# Altium project Motherboard.PrjPcb
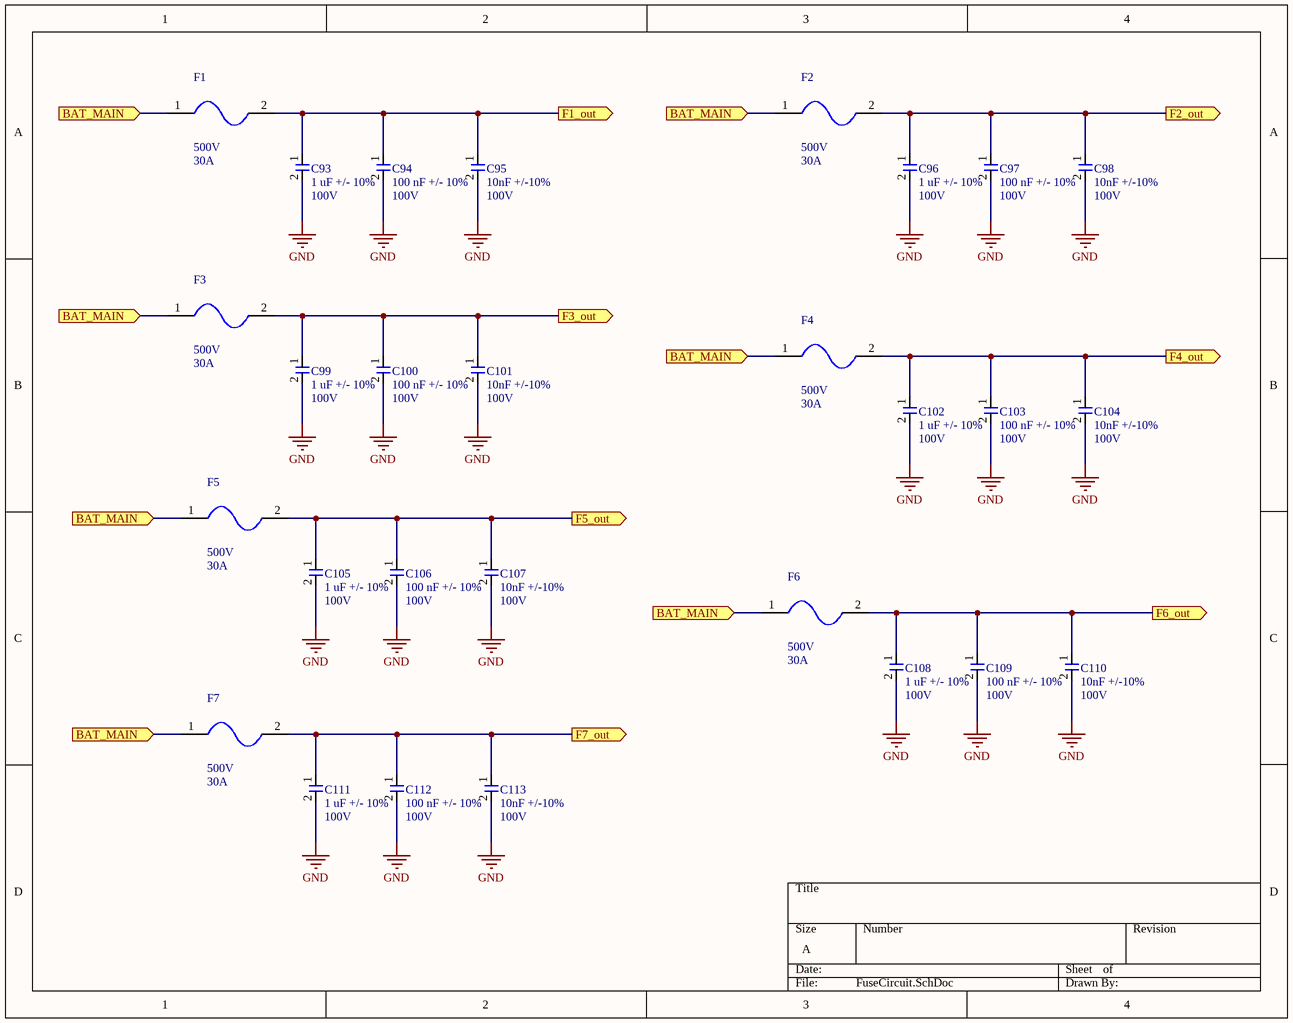
[diagram p0: FuseCircuit.SchDoc]
2 sheets, 41 parts. Net scope: flat (ports and power ports of the same name join across sheets).
Board file: Motherboard.PcbDoc
Sheets:
  FuseCircuit.SchDoc
  MCU_Headers.SchDoc

## Sheet FuseCircuit.SchDoc
size A; SheetNumber: 6; SheetTotal: 8

### Parts
C93  Capacitance: 1 uF +/- 10%  Voltage: 100V  [CAP-1206 - duplicate]  (hidden comment: C1206X105K101T)
C94  Capacitance: 100 nF +/- 10%  Voltage: 100V  [CAP-0603]  (hidden comment: CC0603KRX7R0BB104)
C95  Capacitance: 10nF +/-10%  Voltage Rating: 100V  [CAP-0603]  (hidden comment: CC0603KRX7R0BB103)
C96  Capacitance: 1 uF +/- 10%  Voltage: 100V  [CAP-1206 - duplicate]  (hidden comment: C1206X105K101T)
C97  Capacitance: 100 nF +/- 10%  Voltage: 100V  [CAP-0603]  (hidden comment: CC0603KRX7R0BB104)
C98  Capacitance: 10nF +/-10%  Voltage Rating: 100V  [CAP-0603]  (hidden comment: CC0603KRX7R0BB103)
C99  Capacitance: 1 uF +/- 10%  Voltage: 100V  [CAP-1206 - duplicate]  (hidden comment: C1206X105K101T)
C100  Capacitance: 100 nF +/- 10%  Voltage: 100V  [CAP-0603]  (hidden comment: CC0603KRX7R0BB104)
C101  Capacitance: 10nF +/-10%  Voltage Rating: 100V  [CAP-0603]  (hidden comment: CC0603KRX7R0BB103)
C102  Capacitance: 1 uF +/- 10%  Voltage: 100V  [CAP-1206 - duplicate]  (hidden comment: C1206X105K101T)
C103  Capacitance: 100 nF +/- 10%  Voltage: 100V  [CAP-0603]  (hidden comment: CC0603KRX7R0BB104)
C104  Capacitance: 10nF +/-10%  Voltage Rating: 100V  [CAP-0603]  (hidden comment: CC0603KRX7R0BB103)
C105  Capacitance: 1 uF +/- 10%  Voltage: 100V  [CAP-1206 - duplicate]  (hidden comment: C1206X105K101T)
C106  Capacitance: 100 nF +/- 10%  Voltage: 100V  [CAP-0603]  (hidden comment: CC0603KRX7R0BB104)
C107  Capacitance: 10nF +/-10%  Voltage Rating: 100V  [CAP-0603]  (hidden comment: CC0603KRX7R0BB103)
C108  Capacitance: 1 uF +/- 10%  Voltage: 100V  [CAP-1206 - duplicate]  (hidden comment: C1206X105K101T)
C109  Capacitance: 100 nF +/- 10%  Voltage: 100V  [CAP-0603]  (hidden comment: CC0603KRX7R0BB104)
C110  Capacitance: 10nF +/-10%  Voltage Rating: 100V  [CAP-0603]  (hidden comment: CC0603KRX7R0BB103)
C111  Capacitance: 1 uF +/- 10%  Voltage: 100V  [CAP-1206 - duplicate]  (hidden comment: C1206X105K101T)
C112  Capacitance: 100 nF +/- 10%  Voltage: 100V  [CAP-0603]  (hidden comment: CC0603KRX7R0BB104)
C113  Capacitance: 10nF +/-10%  Voltage Rating: 100V  [CAP-0603]  (hidden comment: CC0603KRX7R0BB103)
F1  Voltage Rating: 500V  Current: 30A  [FUSE-ATM-0001]  (hidden comment: 3568)
F2  Voltage Rating: 500V  Current: 30A  [FUSE-ATM-0001]  (hidden comment: 3568)
F3  Voltage Rating: 500V  Current: 30A  [FUSE-ATM-0001]  (hidden comment: 3568)
F4  Voltage Rating: 500V  Current: 30A  [FUSE-ATM-0001]  (hidden comment: 3568)
F5  Voltage Rating: 500V  Current: 30A  [FUSE-ATM-0001]  (hidden comment: 3568)
F6  Voltage Rating: 500V  Current: 30A  [FUSE-ATM-0001]  (hidden comment: 3568)
F7  Voltage Rating: 500V  Current: 30A  [FUSE-ATM-0001]  (hidden comment: 3568)

### Ports
BAT_MAIN (in), F1_out (out), F2_out (out), F3_out (out), F4_out (out), F5_out (out), F6_out (out), F7_out (out)

### Nets
GND: C93.2 C94.2 C95.2 C96.2 C97.2 C98.2 C99.2 C100.2 C101.2 C102.2 C103.2 C104.2 C105.2 C106.2 C107.2 C108.2 C109.2 C110.2 C111.2 C112.2 C113.2
NetC93_1: C93.1 C94.1 C95.1 F1.2 ; port F1_out
NetC96_1: C96.1 C97.1 C98.1 F2.2 ; port F2_out
NetC99_1: C99.1 C100.1 C101.1 F3.2 ; port F3_out
NetC102_1: C102.1 C103.1 C104.1 F4.2 ; port F4_out
NetC105_1: C105.1 C106.1 C107.1 F5.2 ; port F5_out
NetC108_1: C108.1 C109.1 C110.1 F6.2 ; port F6_out
NetC111_1: C111.1 C112.1 C113.1 F7.2 ; port F7_out
NetF1_1: F1.1 F2.1 F3.1 F4.1 F5.1 F6.1 F7.1 ; port BAT_MAIN

### Library data of the parts
C93 C96 C99 C102 C105 C108 C111 = CAP-1U-0004-JLC: 100V 1uF X7R ±10% 1206 Multilayer Ceramic Capacitors MLCC - SMD/SMT ROHS; assembled: yes; JLC Part Number: C106026
C94 C97 C100 C103 C106 C109 C112 = CAP-100N-0002-JLC: 100V 100nF X7R ±10% 0603 Multilayer Ceramic Capacitors MLCC - SMD/SMT ROHS; assembled?: yes; JLC Part Number: C113803
C95 C98 C101 C104 C107 C110 C113 = CAP-10N-0003-JLC: 100V 10nF X7R ±10% 0603 Multilayer Ceramic Capacitors MLCC - SMD/SMT ROHS; Manufacturer: Yageo; Assembled?: yes; Manufacturer Part Number: CC0603KRX7R0BB103; Temperature Coefficient: X7R; Package Size: 0603; JLC Part Number: C107059
F1-F7 = FUSE-ATM-0001: Fuse Holder 30 A 500V 1 Circuit Blade Through Hole; Manufacturer Part Number: 3568

## Sheet MCU_Headers.SchDoc
size A; SheetNumber: 7; SheetTotal: 8
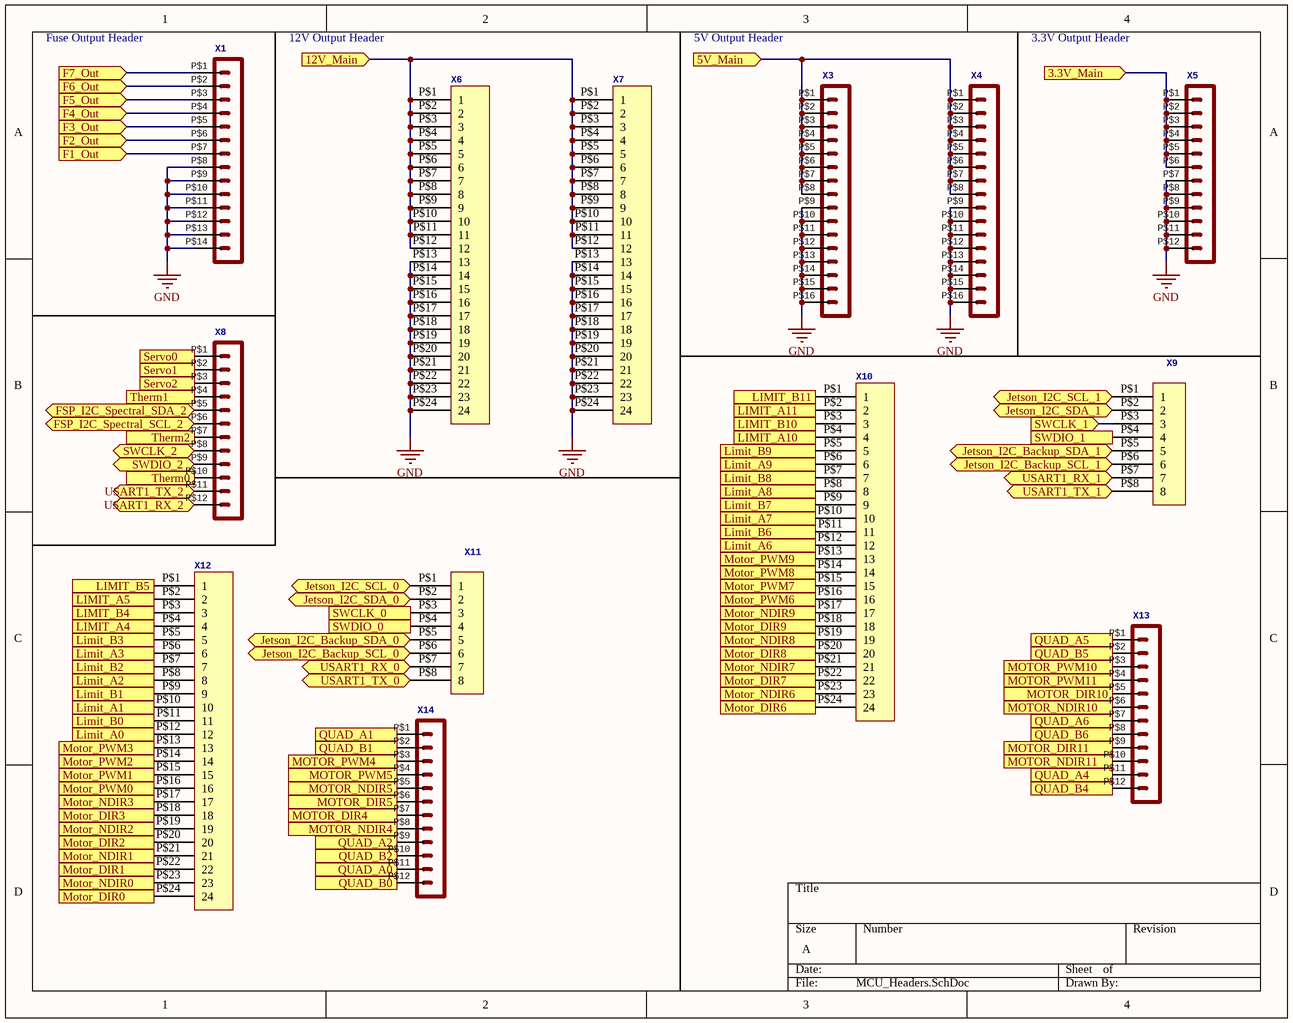
[diagram p1: MCU_Headers.SchDoc]

### Parts
X1  Molex - Micro-Fit 3.0 Series connector,  3.00mm (0.118") pitch header, 14 positions.  [43045-1412]  (value not drawn)
X3  Molex - Micro-Fit 3.0 Series connector,  3.00mm (0.118") pitch header, 16 positions.  [43045-1612]  (value not drawn)
X4  Molex - Micro-Fit 3.0 Series connector,  3.00mm (0.118") pitch header, 16 positions.  [43045-1612]  (value not drawn)
X5  Molex - Micro-Fit 3.0 Series connector,  3.00mm (0.118") pitch header, 12 positions.  [43045-1212]  (value not drawn)
X6  Molex 43045-2412  [43045-2412]  (value not drawn)
X7  Molex 43045-2412  [43045-2412]  (value not drawn)
X8  Molex - Micro-Fit 3.0 Series connector,  3.00mm (0.118") pitch header, 12 positions.  [43045-1212]  (value not drawn)
X9  Molex 43045-0812  [43045-0812]  (value not drawn)
X10  Molex 43045-2412  [43045-2412]  (value not drawn)
X11  Molex 43045-0812  [43045-0812]  (value not drawn)
X12  Molex 43045-2412  [43045-2412]  (value not drawn)
X13  Molex - Micro-Fit 3.0 Series connector,  3.00mm (0.118") pitch header, 12 positions.  [43045-1212]  (value not drawn)
X14  Molex - Micro-Fit 3.0 Series connector,  3.00mm (0.118") pitch header, 12 positions.  [43045-1212]  (value not drawn)

### Ports
3.3V_Main (in), 5V_Main (in), 12V_Main (in), F1_Out (in), F2_Out (in), F3_Out (in), F4_Out (in), F5_Out (in), F6_Out (in), F7_Out (in), FSP_I2C_Spectral_SCL_2 (bidir), FSP_I2C_Spectral_SDA_2 (bidir), Jetson_I2C_Backup_SCL_0 (bidir), Jetson_I2C_Backup_SCL_1 (bidir), Jetson_I2C_Backup_SDA_0 (bidir), Jetson_I2C_Backup_SDA_1 (bidir), Jetson_I2C_SCL_0 (bidir), Jetson_I2C_SCL_1 (bidir), Jetson_I2C_SDA_0 (bidir), Jetson_I2C_SDA_1 (bidir), Limit_A0 (in), Limit_A1 (in), Limit_A2 (in), Limit_A3 (in), LIMIT_A4 (in), LIMIT_A5 (in), Limit_A6 (out), Limit_A7 (out), Limit_A8 (out), Limit_A9 (out), LIMIT_A10 (in), LIMIT_A11 (in), Limit_B0 (in), Limit_B1 (in), Limit_B2 (in), Limit_B3 (in), LIMIT_B4 (in), LIMIT_B5 (in), Limit_B6 (out), Limit_B7 (out), Limit_B8 (out), Limit_B9 (out), LIMIT_B10 (in), LIMIT_B11 (in), Motor_DIR0 (in), Motor_DIR1 (in), Motor_DIR2 (in), Motor_DIR3 (in), MOTOR_DIR4 (in), MOTOR_DIR5 (in), Motor_DIR6 (out), Motor_DIR7 (out), Motor_DIR8 (out), Motor_DIR9 (out), MOTOR_DIR10 (in), MOTOR_DIR11 (in), Motor_NDIR0 (in), Motor_NDIR1 (in), Motor_NDIR2 (in), Motor_NDIR3 (in), MOTOR_NDIR4 (in), MOTOR_NDIR5 (in), Motor_NDIR6 (out), Motor_NDIR7 (out), Motor_NDIR8 (out), Motor_NDIR9 (out), MOTOR_NDIR10 (in), MOTOR_NDIR11 (in), Motor_PWM0 (in), Motor_PWM1 (in), Motor_PWM2 (in), Motor_PWM3 (in), MOTOR_PWM4 (in), MOTOR_PWM5 (in), Motor_PWM6 (out), Motor_PWM7 (out), Motor_PWM8 (out), Motor_PWM9 (out), MOTOR_PWM10 (in), MOTOR_PWM11 (in), QUAD_A0 (in), QUAD_A1 (in), QUAD_A2 (in), QUAD_A4 (in), QUAD_A5 (in), QUAD_A6 (in), QUAD_B0 (in), QUAD_B1 (in), QUAD_B2 (in), QUAD_B4 (in), QUAD_B5 (in), QUAD_B6 (in), Servo0 (in), Servo1 (in), Servo2 (in), SWCLK_0 (in), SWCLK_1 (in), SWCLK_2 (bidir), SWDIO_0 (in), SWDIO_1 (in), SWDIO_2 (bidir), Therm0 (in), Therm1 (in), Therm2 (in), USART1_RX_0 (bidir), USART1_RX_1 (bidir), USART1_RX_2 (bidir), USART1_TX_0 (bidir), USART1_TX_1 (bidir), USART1_TX_2 (bidir)

### Nets
GND: X1.P$8 X1.P$9 X1.P$10 X1.P$11 X1.P$12 X1.P$13 X1.P$14 X3.P$9 X3.P$10 X3.P$11 X3.P$12 X3.P$13 X3.P$14 X3.P$15 X3.P$16 X4.P$9 X4.P$10 X4.P$11 X4.P$12 X4.P$13 X4.P$14 X4.P$15 X4.P$16 X5.P$7 X5.P$8 X5.P$9 X5.P$10 X5.P$11 X5.P$12 X6.P$13(13) X6.P$14(14) X6.P$15(15) X6.P$16(16) X6.P$17(17) X6.P$18(18) X6.P$19(19) X6.P$20(20) X6.P$21(21) X6.P$22(22) X6.P$23(23) X6.P$24(24) X7.P$13(13) X7.P$14(14) X7.P$15(15) X7.P$16(16) X7.P$17(17) X7.P$18(18) X7.P$19(19) X7.P$20(20) X7.P$21(21) X7.P$22(22) X7.P$23(23) X7.P$24(24)
NetC93_1: X1.P$7 ; port F1_Out
NetC96_1: X1.P$6 ; port F2_Out
NetC99_1: X1.P$5 ; port F3_Out
NetC102_1: X1.P$4 ; port F4_Out
NetC105_1: X1.P$3 ; port F5_Out
NetC108_1: X1.P$2 ; port F6_Out
NetC111_1: X1.P$1 ; port F7_Out
NetX3_P$1: X3.P$1 X3.P$2 X3.P$3 X3.P$4 X3.P$5 X3.P$6 X3.P$7 X3.P$8 X4.P$1 X4.P$2 X4.P$3 X4.P$4 X4.P$5 X4.P$6 X4.P$7 X4.P$8 ; port 5V_Main
NetX5_P$1: X5.P$1 X5.P$2 X5.P$3 X5.P$4 X5.P$5 X5.P$6 ; port 3.3V_Main
NetX6_P$1: X6.P$1(1) X6.P$2(2) X6.P$3(3) X6.P$4(4) X6.P$5(5) X6.P$6(6) X6.P$7(7) X6.P$8(8) X6.P$9(9) X6.P$10(10) X6.P$11(11) X6.P$12(12) X7.P$1(1) X7.P$2(2) X7.P$3(3) X7.P$4(4) X7.P$5(5) X7.P$6(6) X7.P$7(7) X7.P$8(8) X7.P$9(9) X7.P$10(10) X7.P$11(11) X7.P$12(12) ; port 12V_Main
NetX8_P$1: X8.P$1 ; port Servo0
NetX8_P$2: X8.P$2 ; port Servo1
NetX8_P$3: X8.P$3 ; port Servo2
NetX8_P$4: X8.P$4 ; port Therm1
NetX8_P$5: X8.P$5 ; port FSP_I2C_Spectral_SDA_2
NetX8_P$6: X8.P$6 ; port FSP_I2C_Spectral_SCL_2
NetX8_P$7: X8.P$7 ; port Therm2
NetX8_P$8: X8.P$8 ; port SWCLK_2
NetX8_P$9: X8.P$9 ; port SWDIO_2
NetX8_P$10: X8.P$10 ; port Therm0
NetX8_P$11: X8.P$11 ; port USART1_TX_2
NetX8_P$12: X8.P$12 ; port USART1_RX_2
NetX9_P$1: X9.P$1(1) ; port Jetson_I2C_SCL_1
NetX9_P$2: X9.P$2(2) ; port Jetson_I2C_SDA_1
NetX9_P$3: X9.P$3(3) ; port SWCLK_1
NetX9_P$4: X9.P$4(4) ; port SWDIO_1
NetX9_P$5: X9.P$5(5) ; port Jetson_I2C_Backup_SDA_1
NetX9_P$6: X9.P$6(6) ; port Jetson_I2C_Backup_SCL_1
NetX9_P$7: X9.P$7(7) ; port USART1_RX_1
NetX9_P$8: X9.P$8(8) ; port USART1_TX_1
NetX10_P$1: X10.P$1(1) ; port LIMIT_B11
NetX10_P$2: X10.P$2(2) ; port LIMIT_A11
NetX10_P$3: X10.P$3(3) ; port LIMIT_B10
NetX10_P$4: X10.P$4(4) ; port LIMIT_A10
NetX10_P$5: X10.P$5(5) ; port Limit_B9
NetX10_P$6: X10.P$6(6) ; port Limit_A9
NetX10_P$7: X10.P$7(7) ; port Limit_B8
NetX10_P$8: X10.P$8(8) ; port Limit_A8
NetX10_P$9: X10.P$9(9) ; port Limit_B7
NetX10_P$10: X10.P$10(10) ; port Limit_A7
NetX10_P$11: X10.P$11(11) ; port Limit_B6
NetX10_P$12: X10.P$12(12) ; port Limit_A6
NetX10_P$13: X10.P$13(13) ; port Motor_PWM9
NetX10_P$14: X10.P$14(14) ; port Motor_PWM8
NetX10_P$15: X10.P$15(15) ; port Motor_PWM7
NetX10_P$16: X10.P$16(16) ; port Motor_PWM6
NetX10_P$17: X10.P$17(17) ; port Motor_NDIR9
NetX10_P$18: X10.P$18(18) ; port Motor_DIR9
NetX10_P$19: X10.P$19(19) ; port Motor_NDIR8
NetX10_P$20: X10.P$20(20) ; port Motor_DIR8
NetX10_P$21: X10.P$21(21) ; port Motor_NDIR7
NetX10_P$22: X10.P$22(22) ; port Motor_DIR7
NetX10_P$23: X10.P$23(23) ; port Motor_NDIR6
NetX10_P$24: X10.P$24(24) ; port Motor_DIR6
NetX11_P$1: X11.P$1(1) ; port Jetson_I2C_SCL_0
NetX11_P$2: X11.P$2(2) ; port Jetson_I2C_SDA_0
NetX11_P$3: X11.P$3(3) ; port SWCLK_0
NetX11_P$4: X11.P$4(4) ; port SWDIO_0
NetX11_P$5: X11.P$5(5) ; port Jetson_I2C_Backup_SDA_0
NetX11_P$6: X11.P$6(6) ; port Jetson_I2C_Backup_SCL_0
NetX11_P$7: X11.P$7(7) ; port USART1_RX_0
NetX11_P$8: X11.P$8(8) ; port USART1_TX_0
NetX12_P$1: X12.P$1(1) ; port LIMIT_B5
NetX12_P$2: X12.P$2(2) ; port LIMIT_A5
NetX12_P$3: X12.P$3(3) ; port LIMIT_B4
NetX12_P$4: X12.P$4(4) ; port LIMIT_A4
NetX12_P$5: X12.P$5(5) ; port Limit_B3
NetX12_P$6: X12.P$6(6) ; port Limit_A3
NetX12_P$7: X12.P$7(7) ; port Limit_B2
NetX12_P$8: X12.P$8(8) ; port Limit_A2
NetX12_P$9: X12.P$9(9) ; port Limit_B1
NetX12_P$10: X12.P$10(10) ; port Limit_A1
NetX12_P$11: X12.P$11(11) ; port Limit_B0
NetX12_P$12: X12.P$12(12) ; port Limit_A0
NetX12_P$13: X12.P$13(13) ; port Motor_PWM3
NetX12_P$14: X12.P$14(14) ; port Motor_PWM2
NetX12_P$15: X12.P$15(15) ; port Motor_PWM1
NetX12_P$16: X12.P$16(16) ; port Motor_PWM0
NetX12_P$17: X12.P$17(17) ; port Motor_NDIR3
NetX12_P$18: X12.P$18(18) ; port Motor_DIR3
NetX12_P$19: X12.P$19(19) ; port Motor_NDIR2
NetX12_P$20: X12.P$20(20) ; port Motor_DIR2
NetX12_P$21: X12.P$21(21) ; port Motor_NDIR1
NetX12_P$22: X12.P$22(22) ; port Motor_DIR1
NetX12_P$23: X12.P$23(23) ; port Motor_NDIR0
NetX12_P$24: X12.P$24(24) ; port Motor_DIR0
NetX13_P$1: X13.P$1 ; port QUAD_A5
NetX13_P$2: X13.P$2 ; port QUAD_B5
NetX13_P$3: X13.P$3 ; port MOTOR_PWM10
NetX13_P$4: X13.P$4 ; port MOTOR_PWM11
NetX13_P$5: X13.P$5 ; port MOTOR_DIR10
NetX13_P$6: X13.P$6 ; port MOTOR_NDIR10
NetX13_P$7: X13.P$7 ; port QUAD_A6
NetX13_P$8: X13.P$8 ; port QUAD_B6
NetX13_P$9: X13.P$9 ; port MOTOR_DIR11
NetX13_P$10: X13.P$10 ; port MOTOR_NDIR11
NetX13_P$11: X13.P$11 ; port QUAD_A4
NetX13_P$12: X13.P$12 ; port QUAD_B4
NetX14_P$1: X14.P$1 ; port QUAD_A1
NetX14_P$2: X14.P$2 ; port QUAD_B1
NetX14_P$3: X14.P$3 ; port MOTOR_PWM4
NetX14_P$4: X14.P$4 ; port MOTOR_PWM5
NetX14_P$5: X14.P$5 ; port MOTOR_NDIR5
NetX14_P$6: X14.P$6 ; port MOTOR_DIR5
NetX14_P$7: X14.P$7 ; port MOTOR_DIR4
NetX14_P$8: X14.P$8 ; port MOTOR_NDIR4
NetX14_P$9: X14.P$9 ; port QUAD_A2
NetX14_P$10: X14.P$10 ; port QUAD_B2
NetX14_P$11: X14.P$11 ; port QUAD_A0
NetX14_P$12: X14.P$12 ; port QUAD_B0

### Notes on the sheet
- Fuse Output Header
- 12V Output Header
- 5V Output Header
- 3.3V Output Header

### Library data of the parts
X1 = HEADER_POS14_?43045-1412: GateName_1: G$1; SymbolName_1: HEADER_POS14; DeviceName: 43045-1412; LibraryName: con-molex-micro-fit-3_0_2; DeviceSetName: HEADER_POS14_?; Package: 43045-1412
X3 X4 = HEADER_POS16_?43045-1612: GateName_1: G$1; SymbolName_1: HEADER_POS16; DeviceName: 43045-1612; LibraryName: con-molex-micro-fit-3_0_2; DeviceSetName: HEADER_POS16_?; Package: 43045-1612
X5 X8 X13 X14 = HEADER_POS12_?43045-1212: GateName_1: G$1; SymbolName_1: HEADER_POS12; DeviceName: 43045-1212; LibraryName: con-molex-micro-fit-3_0_2; DeviceSetName: HEADER_POS12_?; Package: 43045-1212
X6 X7 X10 X12 = Micro-Fit Molex 24 Pin Vertical: GateName_1: G$1; SymbolName_1: HEADER_POS24; DeviceSetName: HEADER_POS24_?; DeviceName: 43045-2412; LibraryName: con-molex-micro-fit-3_0_2; Package: 43045-2412
X9 X11 = Micro-Fit Molex 8 Pin 2 Row Vertical: GateName_1: G$1; SymbolName_1: HEADER_POS8; DeviceSetName: HEADER_POS8_?; DeviceName: 43045-0812; LibraryName: con-molex-micro-fit-3_0_2; Package: 43045-0812

## Nets that join several sheets
GND: FuseCircuit (21 pins), MCU_Headers (53 pins)
NetC93_1: FuseCircuit (C93.1 C94.1 C95.1 F1.2), MCU_Headers (X1.P$7)
NetC96_1: FuseCircuit (C96.1 C97.1 C98.1 F2.2), MCU_Headers (X1.P$6)
NetC99_1: FuseCircuit (C99.1 C100.1 C101.1 F3.2), MCU_Headers (X1.P$5)
NetC102_1: FuseCircuit (C102.1 C103.1 C104.1 F4.2), MCU_Headers (X1.P$4)
NetC105_1: FuseCircuit (C105.1 C106.1 C107.1 F5.2), MCU_Headers (X1.P$3)
NetC108_1: FuseCircuit (C108.1 C109.1 C110.1 F6.2), MCU_Headers (X1.P$2)
NetC111_1: FuseCircuit (C111.1 C112.1 C113.1 F7.2), MCU_Headers (X1.P$1)